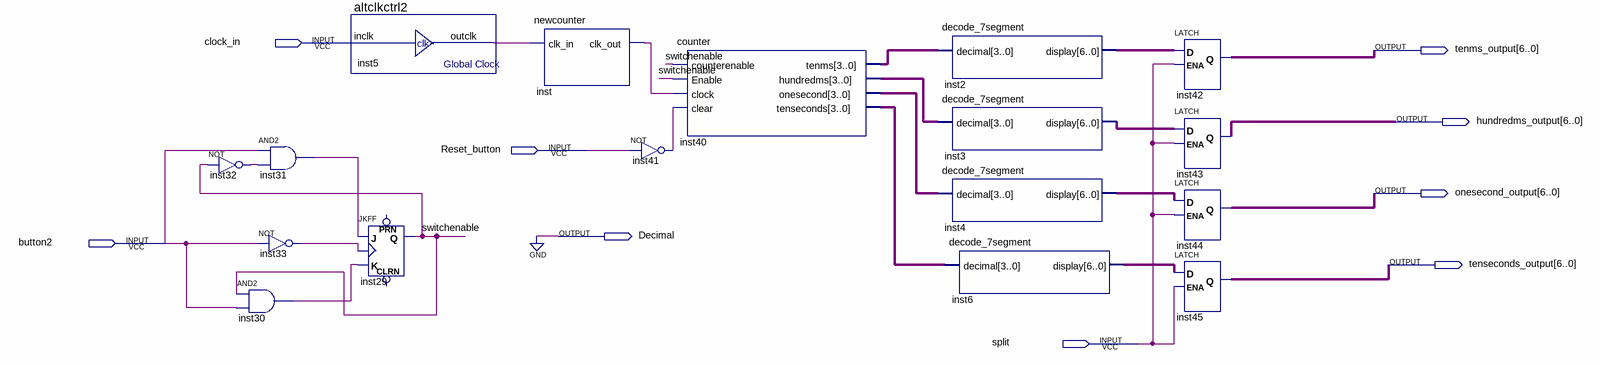
[diagram p0: schematic sheet]
// Quartus schematic stopwatchtimes.bdf as structural Verilog: 17 symbols, 9 pins
module stopwatchtimes (
  input  clock_in,
  input  Reset_button,
  input  button2,
  input  split,
  output [6:0] tenms_output,
  output [6:0] hundredms_output,
  output [6:0] onesecond_output,
  output Decimal,
  output [6:0] tenseconds_output
);

  wire inst5_outclk, inst30_out, inst31_out, inst32_out, inst33_out, inst41_out, inst_clk_out, switchenable;
  wire [3:0] inst40_hundredms, inst40_onesecond, inst40_tenms, inst40_tenseconds;
  wire [6:0] inst2_display, inst3_display, inst4_display, inst6_display;

  not inst32 (inst32_out, switchenable);
  and inst31 (inst31_out, button2, inst32_out);
  not inst33 (inst33_out, button2);
  and inst30 (inst30_out, switchenable, button2);
  altclkctrl2 inst5 (.inclk(clock_in), .outclk(inst5_outclk));
  JKFF inst29 (.K(inst30_out), .J(inst31_out), .CLK(inst33_out), .Q(switchenable));  // open: PRN, CLRN
  newcounter inst (.clk_in(inst5_outclk), .clk_out(inst_clk_out));
  not inst41 (inst41_out, Reset_button);
  counter inst40 (
    .counterenable(switchenable), .Enable(switchenable), .clock(inst_clk_out), .clear(inst41_out),
    .tenms(inst40_tenms), .hundredms(inst40_hundredms), .onesecond(inst40_onesecond),
    .tenseconds(inst40_tenseconds));
  decode_7segment inst2 (.decimal(inst40_tenms), .display(inst2_display));
  decode_7segment inst3 (.decimal(inst40_hundredms), .display(inst3_display));
  decode_7segment inst4 (.decimal(inst40_onesecond), .display(inst4_display));
  decode_7segment inst6 (.decimal(inst40_tenseconds), .display(inst6_display));
  LATCH inst42[6:0] (.D(inst2_display), .ENA(split), .Q(tenms_output));
  LATCH inst43[6:0] (.D(inst3_display), .ENA(split), .Q(hundredms_output));
  LATCH inst44[6:0] (.D(inst4_display), .ENA(split), .Q(onesecond_output));
  LATCH inst45[6:0] (.D(inst6_display), .ENA(split), .Q(tenseconds_output));

  assign Decimal = 1'b0;
endmodule
